# Altium schematic sheet micro.SchDoc
size A4
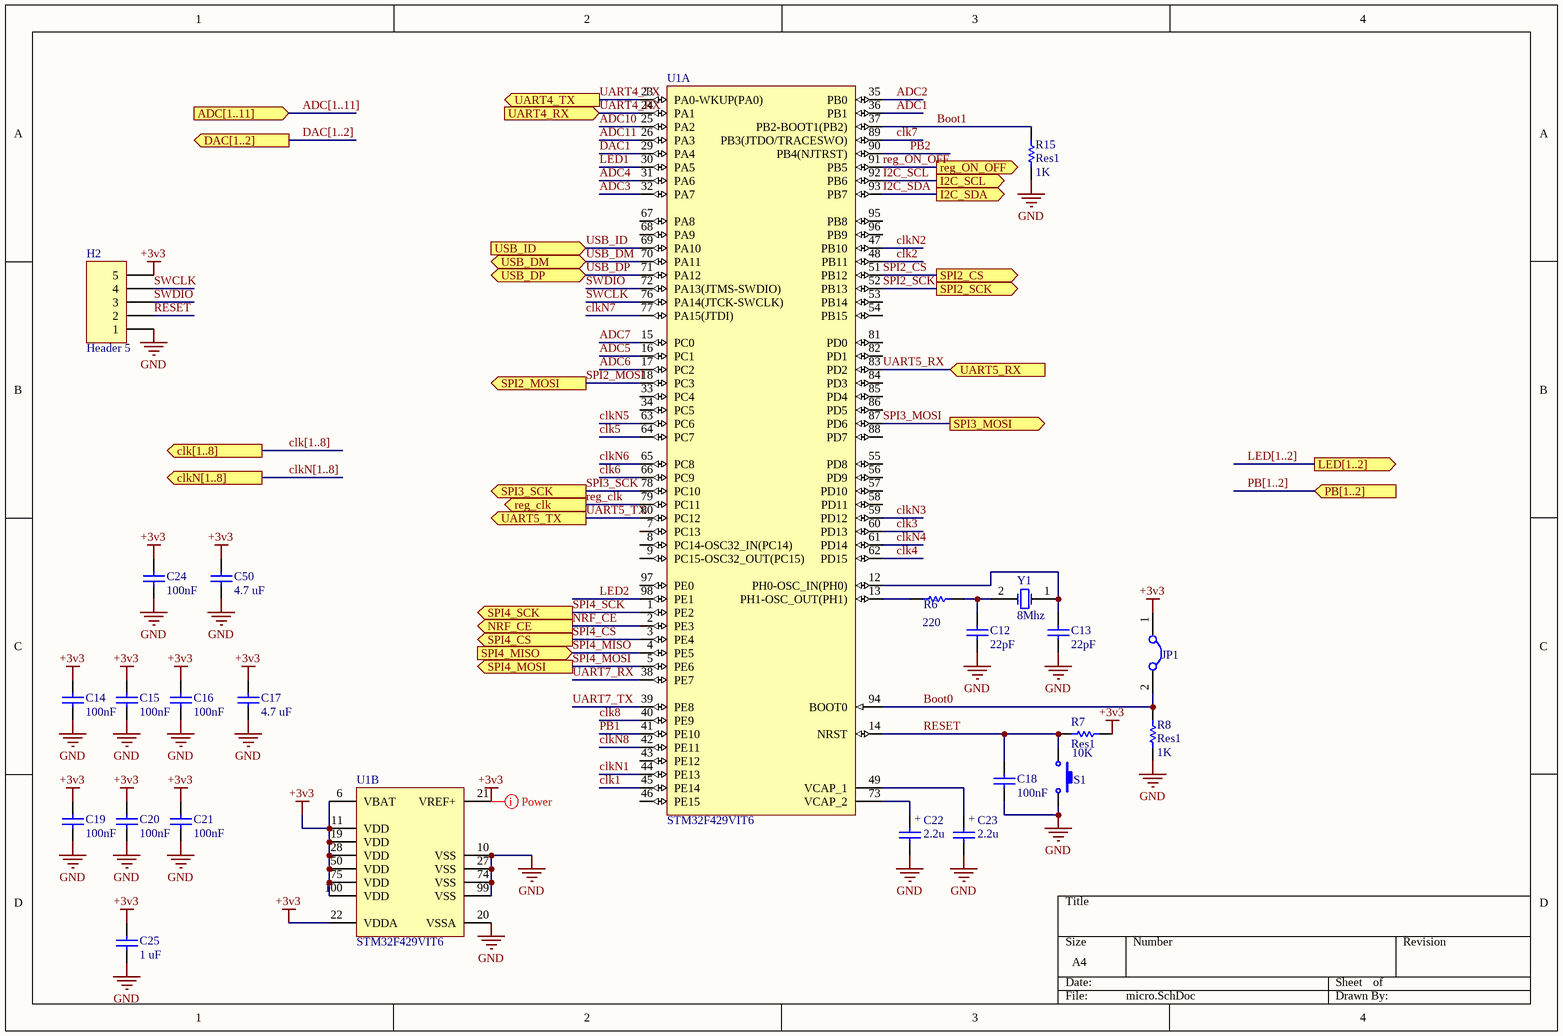
[diagram p0: micro.SchDoc]

## Parts
C12  value 22pF  [SMD_CAP_0805]  (hidden comment: Cap)
C13  value 22pF  [SMD_CAP_0805]  (hidden comment: Cap)
C14  100nF  [SMD_CAP_0805]
C15  100nF  [SMD_CAP_0805]
C16  100nF  [SMD_CAP_0805]
C17  value 4.7 uF  [SMD_CAP_0805]  (hidden comment: Cap)
C18  value 100nF  [SMD_CAP_0805]  (hidden comment: Cap)
C19  100nF  [SMD_CAP_0805]
C20  100nF  [SMD_CAP_0805]
C21  100nF  [SMD_CAP_0805]
C22  value 2.2u  [CAPP 1206 (3216X18L) Size A]  (hidden comment: tantal size a)
C23  value 2.2u  [CAPP 1206 (3216X18L) Size A]  (hidden comment: tantal size a)
C24  100nF  [SMD_CAP_0805]
C25  value 1 uF  [CAPP 1206 (3216X18L) Size A]  (hidden comment: Cap)
C50  value 4.7 uF  [SMD_CAP_0805]  (hidden comment: Cap)
H2  Header 5  [HDR1X5]
JP1  Jumper  [Jumper Small - 2.54 - GRAY]  (value not drawn)
R6  value 220  [RES 0805 (2012X06L)]  (hidden comment: Res1)
R7  Res1  value 10K  [RES 0805 (2012X06L)]
R8  Res1  value 1K  [RES 0805 (2012X06L)]
R15  Res1  value 1K  [RES 0805 (2012X06L)]
S1  Switch PB  [Switch - Push to On]  (value not drawn)
U1  STM32F429VIT6  [STM-LQFP100_M]  (parts A,B of 2)
Y1  8Mhz  [CRYSTAL Small]

## Ports
ADC[1..11] (in), clk[1..8] (out), clkN[1..8] (out), DAC[1..2] (out), I2C_SCL (out), I2C_SDA (out), LED[1..2] (out), NRF_CE (out), PB[1..2] (in), reg_clk (out), reg_ON_OFF (out), SPI2_CS (out), SPI2_MOSI (out), SPI2_SCK (out), SPI3_MOSI (out), SPI3_SCK (out), SPI4_CS (out), SPI4_MISO (in), SPI4_MOSI (out), SPI4_SCK (out), UART4_RX (in), UART4_TX (out), UART5_RX (in), UART5_TX (out), USB_DM (bidir), USB_DP (bidir), USB_ID (in)

## Nets
+3v3: C14.2 C15.2 C16.2 C17.1 C19.2 C20.2 C21.2 C24.2 C25.1 C50.1 H2.5 JP1.1 R7.1 U1.6(VBAT) U1.11(VDD) U1.19(VDD) U1.21(VREF+) U1.22(VDDA) U1.28(VDD) U1.50(VDD) U1.75(VDD) U1.100(VDD)
GND: C12.1 C13.1 C14.1 C15.1 C16.1 C17.2 C18.1 C19.1 C20.1 C21.1 C22.- C23.- C24.1 C25.2 C50.2 H2.1 R8.1 R15.1 S1.2 U1.10(VSS) U1.20(VSSA) U1.27(VSS) U1.74(VSS) U1.99(VSS)
ADC1: U1.36(PB1)
ADC2: U1.35(PB0)
ADC3: U1.32(PA7)
ADC4: U1.31(PA6)
ADC5: U1.16(PC1)
ADC6: U1.17(PC2)
ADC7: U1.15(PC0)
ADC10: U1.25(PA2)
ADC11: U1.26(PA3)
Boot0: JP1.2 R8.2 U1.94(BOOT0)
Boot1: R15.2 U1.37(PB2-BOOT1(PB2))
clk1: U1.45(PE14)
clk2: U1.48(PB11)
clk3: U1.60(PD13)
clk4: U1.62(PD15)
clk5: U1.64(PC7)
clk6: U1.66(PC9)
clk7: U1.89(PB3(JTDO/TRACESWO))
clk8: U1.40(PE9)
clkN1: U1.44(PE13)
clkN2: U1.47(PB10)
clkN3: U1.59(PD12)
clkN4: U1.61(PD14)
clkN5: U1.63(PC6)
clkN6: U1.65(PC8)
clkN7: U1.77(PA15(JTDI))
clkN8: U1.42(PE11)
DAC1: U1.29(PA4)
I2C_SCL: U1.92(PB6) ; port I2C_SCL
I2C_SDA: U1.93(PB7) ; port I2C_SDA
LED1: U1.30(PA5)
LED2: U1.98(PE1)
NRF_CE: U1.2(PE3) ; port NRF_CE
PB1: U1.41(PE10)
PB2: U1.90(PB4(NJTRST))
reg_clk: U1.79(PC11) ; port reg_clk
reg_ON_OFF: U1.91(PB5) ; port reg_ON_OFF
RESET: C18.2 H2.2 R7.2 S1.1 U1.14(NRST)
SPI2_CS: U1.51(PB12) ; port SPI2_CS
SPI2_MOSI: U1.18(PC3) ; port SPI2_MOSI
SPI2_SCK: U1.52(PB13) ; port SPI2_SCK
SPI3_MOSI: U1.87(PD6) ; port SPI3_MOSI
SPI3_SCK: U1.78(PC10) ; port SPI3_SCK
SPI4_CS: U1.3(PE4) ; port SPI4_CS
SPI4_MISO: U1.4(PE5) ; port SPI4_MISO
SPI4_MOSI: U1.5(PE6) ; port SPI4_MOSI
SPI4_SCK: U1.1(PE2) ; port SPI4_SCK
SWCLK: H2.4 U1.76(PA14(JTCK-SWCLK))
SWDIO: H2.3 U1.72(PA13(JTMS-SWDIO))
UART4_RX: U1.24(PA1) ; port UART4_RX
UART4_TX: U1.23(PA0-WKUP(PA0)) ; port UART4_TX
UART5_RX: U1.83(PD2) ; port UART5_RX
UART5_TX: U1.80(PC12) ; port UART5_TX
UART7_RX: U1.38(PE7)
UART7_TX: U1.39(PE8)
USB_DM: U1.70(PA11) ; port USB_DM
USB_DP: U1.71(PA12) ; port USB_DP
USB_ID: U1.69(PA10) ; port USB_ID
NetC12_2: C12.2 R6.2 Y1.2(OSC2)
NetC13_2: C13.2 U1.12(PH0-OSC_IN(PH0)) Y1.1(OSC1)
NetC22_+: C22.+ U1.73(VCAP_2)
NetC23_+: C23.+ U1.49(VCAP_1)
NetR6_1: R6.1 U1.13(PH1-OSC_OUT(PH1))

Not connected (* = marked no-connect by the designer): U1 7(PC13) 8(PC14-OSC32_IN(PC14)) 9(PC15-OSC32_OUT(PC15)) 33(PC4) 34(PC5) 43(PE12) 46(PE15) 53(PB14) 54(PB15) 55(PD8) 56(PD9) 57(PD10) 58(PD11) 67(PA8) 68(PA9) 81(PD0) 82(PD1) 84(PD3) 85(PD4) 86(PD5) 88(PD7) 95(PB8) 96(PB9) 97(PE0)

## Buses and harness runs
bus ADC[1..11] = port ADC[1..11]
bus clk[1..8] = port clk[1..8]
bus clkN[1..8] = port clkN[1..8]
bus DAC[1..2] = port DAC[1..2]
bus LED[1..2] = port LED[1..2]
bus PB[1..2] = port PB[1..2]

## Layout directives
net class Power: +3v3

## Library data of the parts
C12-C16 C18-C21 C24 = Cap: Capacitor; Published: 8-Jun-2000; LatestRevisionDate: 17-Jul-2002; LatestRevisionNote: Re-released for DXP Platform.; PackageReference: RAD-0.3; Publisher: Altium Limited; PackageDescription: Radial Cap, Thru-Hole; 2 Leads; 0.3 in Pin Spacing
  C14-C16 C19-C21 C24: Value: 100nF
C22 C23 = Cap Pol: pin to pad: +>1 ->2
H2 = Header 5: Header, 5-Pin; LatestRevisionDate: 17-Jul-2002; LatestRevisionNote: Re-released for DXP Platform.; Publisher: Altium Limited
JP1 = Jumper: Company: E.P.I.L; Defualt State: Close; Design Date: 2011/11/02
R6-R8 R15 = Res1: Resistor; Published: 8-Jun-2000; LatestRevisionDate: 17-Jul-2002; LatestRevisionNote: Re-released for DXP Platform.; PackageReference: AXIAL-0.3; Publisher: Altium Limited; PackageDescription: Axial Device, Thru-Hole; 2 Leads; 0.3 in Pin Spacing
S1 = Switch PB: Push Button Switch
U1 = STM32F429VIT6: ARM Cortex-M4 32-bit MCU+FPU, 225 DMIPS, 2048 kB Flash, 256 kB Internal RAM, 82 I/Os, 100-pin LQFP, -40 to 85 degC, Tray; Manufacturer: STMicroelectronics; D/A Converter: 2x12-bit; FLASH Size (Prog) (kB): 2048; I/Os (High Current): 82; Internal RAM Size (kB): 256; Operating Frequency(F) (Processor speed) (MHz): 180; Supply Voltage(Vcc) max (V): 3.6; Supply Voltage(Vcc) min (V): 1.8; DatasheetVersion: Rev. 2; PackageVersion: Rev. 1, 06/2013; PackageReference: LQFP100; PackageDescription: 100-Pin Low Profile Quad Flat Package, 14 x 14 mm Body, 0.5 mm Pitch; Supplier 1: Digi-Key; Supplier Part Number 1: 497-14052-ND; Supplier 2: Newark; Supplier Part Number 2: 06X3674; Supplier 3: Mouser; Supplier Part Number 3: 511-STM32F429VIT6; Core: ARM Cortex-M4; Packing: Tray; Mounting Technology: Surface Mount; PartNumber: STM32F429VIT6; ComponentLink1Description: Manufacturer URL; ComponentLink1URL: http://www.st.com/web/en/home.html; ComponentLink2Description: Datasheet; ComponentLink2URL: http://www.st.com/st-web-ui/static/active/en/resource/technical/document/data_brief/DM00053488.pdf; ComponentLink3Description: Package Specification; ComponentLink3URL: http://www.st.com/st-web-ui/static/active/en/resource/technical/document/data_brief/DM00071938.pdf
Y1 = XTAL: Crystal Oscillator; Published: 8-Jun-2000; LatestRevisionDate: 17-Jul-2002; LatestRevisionNote: Re-released for DXP Platform.; PackageReference: R38; Publisher: Altium Limited; PackageDescription: Crystal, Thru-Hole; 2 Leads; Body 3.1 x 8.2 mm (Dia.xH)